# Altium schematic sheet SENSORS_FMU_REV_2A.SchDoc: Cube Yellow and Cube Orange
size A3; Date: 18/08/2014 1:53:16 PM; Author: PR; DrawnBy: Philip Rowse; Engineer: Philip Rowse; Organization: ProfiCNC/Hex; Address3: VIC; Address4: Australia; Revision: A; SheetNumber: 9; SheetTotal: 10
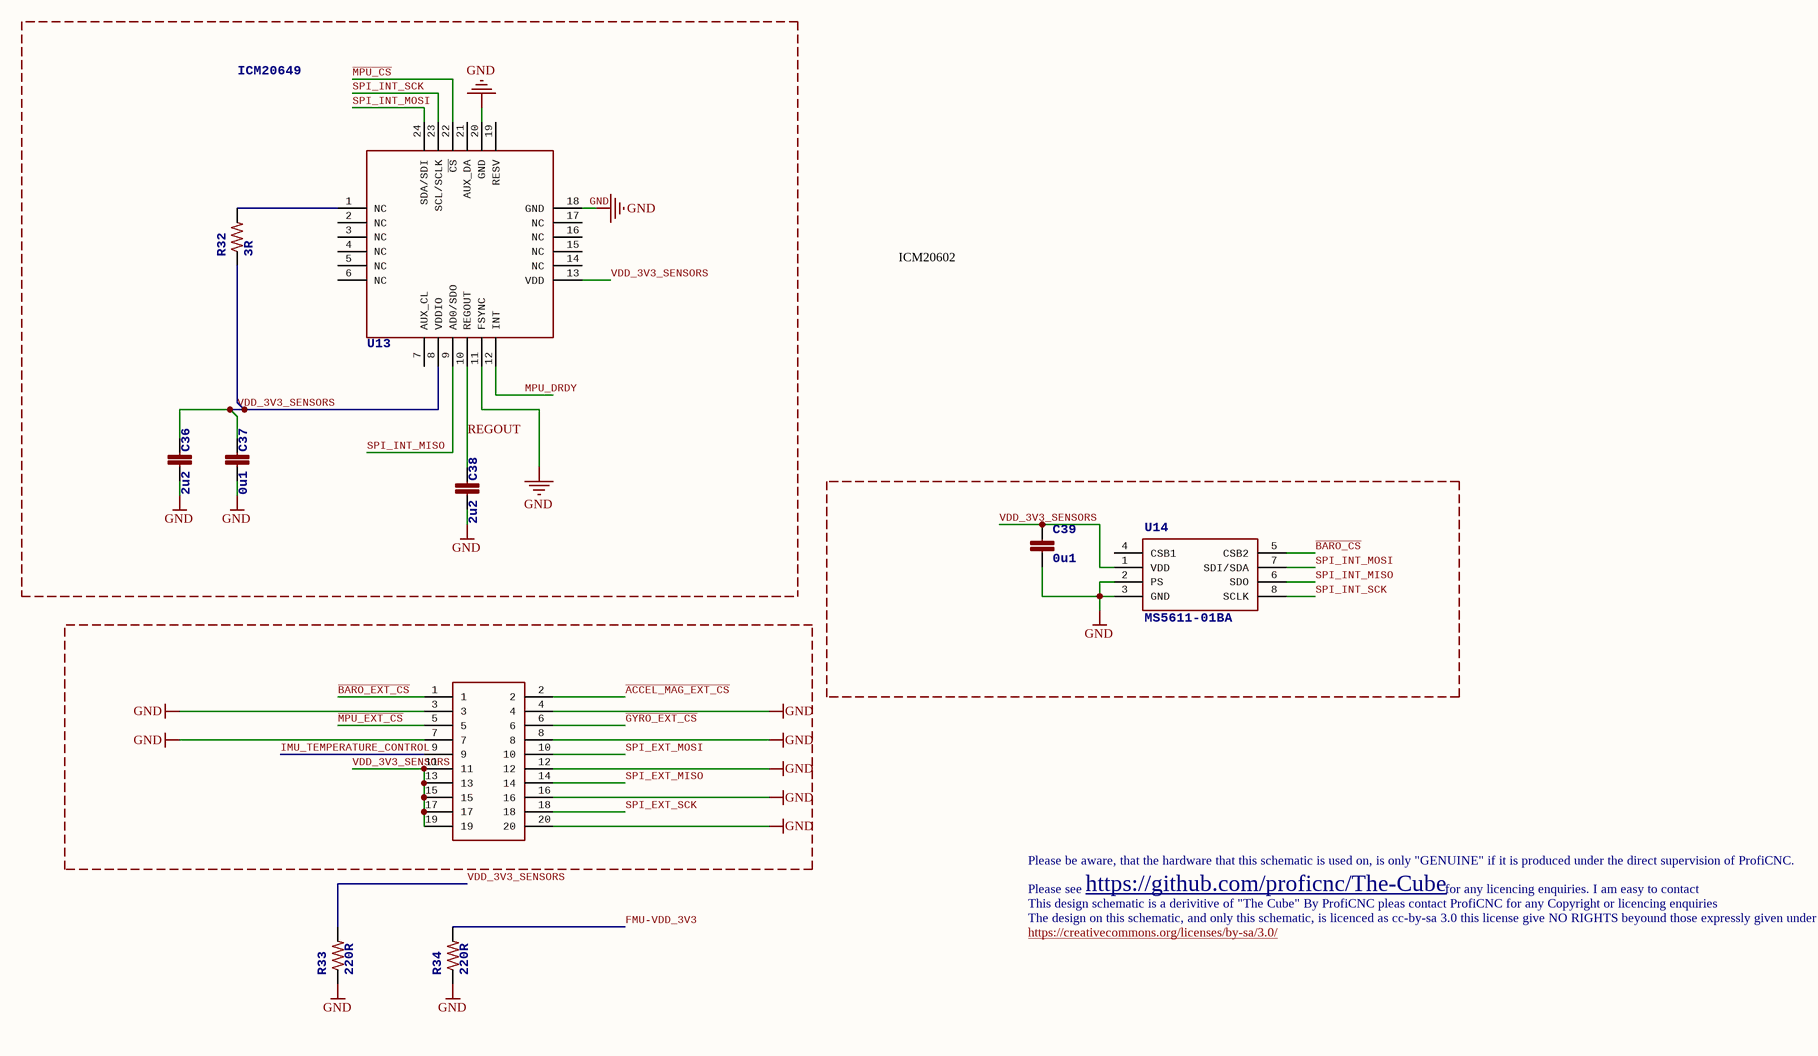
[diagram p0: SENSORS_FMU_REV_2A.SchDoc]

## Parts
C36  2u2  [0603-CAP]
C37  0u1  [0402-CAP]
C38  2u2  [0603-CAP]
C39  0u1  [0402-CAP]
R32  3R  [0201-RES]  (no BOM)
R33  220R  [0402-RES]
R34  220R  [0402-RES]
U13  ICM20649  [ICM20649]
U14  MS5611-01BA  [MS5611-01BA]
U$2  DF40C-20-DS  [DF-40C-20DS]  (value not drawn)

## Nets
GND: C36.P$2 C37.P$2 C38.P$2 C39.P$2 R33.P$1 R34.P$1 U13.11(FSYNC) U13.18(GND) U13.20(GND) U14.2(PS) U14.3(GND) U$2.3 U$2.4 U$2.7 U$2.8 U$2.12 U$2.16 U$2.20
~{ACCEL_MAG_EXT_CS}: U$2.2
~{BARO_CS}: U14.5(CSB2)
~{BARO_EXT_CS}: U$2.1
FMU-VDD_3V3: R34.P$2
~{GYRO_EXT_CS}: U$2.6
IMU_TEMPERATURE_CONTROL: U$2.9
~{MPU_CS}: U13.22(~{CS})
~{MPU_EXT_CS}: U$2.5
MPU_DRDY: U13.12(INT)
REGOUT: C38.P$1 U13.10(REGOUT)
SPI_EXT_MISO: U$2.14
SPI_EXT_MOSI: U$2.10
SPI_EXT_SCK: U$2.18
SPI_INT_MISO: U13.9(AD0/SDO) U14.6(SDO)
SPI_INT_MOSI: U13.24(SDA/SDI) U14.7(SDI/SDA)
SPI_INT_SCK: U13.23(SCL/SCLK) U14.8(SCLK)
VDD_3V3_SENSORS: C36.P$1 C37.P$1 C39.P$1 R32.1 R33.P$2 U13.8(VDDIO) U13.13(VDD) U14.1(VDD) U$2.11 U$2.13 U$2.15 U$2.17 U$2.19
NetR32_2: R32.2 U13.1(NC)

Not connected (* = marked no-connect by the designer): U13 2(NC) 3(NC) 4(NC) 5(NC) 6(NC) 7(AUX_CL) 14(NC) 15(NC) 16(NC) 17(NC) 19(RESV) 21(AUX_DA); U14 4(CSB1)

## Notes on the sheet
- ICM20602
  1428-1060-2-ND
  ICM20649
- Please be aware, that the hardware that this schematic is used on, is only "GENUINE" if it is produced under the direct supervision of ProfiCNC.
- The design on this schematic, and only this schematic, is licenced as cc-by-sa 3.0 this license give NO RIGHTS beyound those expressly given under the terms of this license.
- This design schematic is a derivitive of "The Cube" By ProfiCNC pleas contact ProfiCNC for any Copyright or licencing enquiries
- https://creativecommons.org/licenses/by-sa/3.0/
- Please see
- https://github.com/proficnc/The-Cube
- for any licencing enquiries. I am easy to contact
- Drawn By:
- Verified for production by:
- Approved for release:
- Title
- Size:
- Date:
- A
- Number:
- Time:
- Revision:
- Sheet
- of
- File:

## Library data of the parts
C36 C38 = CAP0603: CAP CER 2.2UF 16V 10% X6S 0603; Value: 2u2
C37 C39 = CAP0402: CAP CER 0.1UF 16V Y5V 0402; Value: 0u1
R32 = RESISTOR0402-RES: RES 3OHM 1/16W 1% 0201 SMD
R33 R34 = RESISTOR0402-RES: RES 220 OHM 1/16W 1% 0402 SMD; Value: 220R
U14 = MS5611-01BA: Board Mount Pressure Sensors; Value: 10-1200mbar
U$2 = DF40C-20-DS: CONN RCPT 20POS 0.4MM SMD GOLD